# Altium schematic sheet BLOCK DIAGRAM.SchDoc
size A3; Date: 10/11/2025; Author: Hung Le; Revision: v1; SheetNumber: 2; SheetTotal: 3; Size: A3
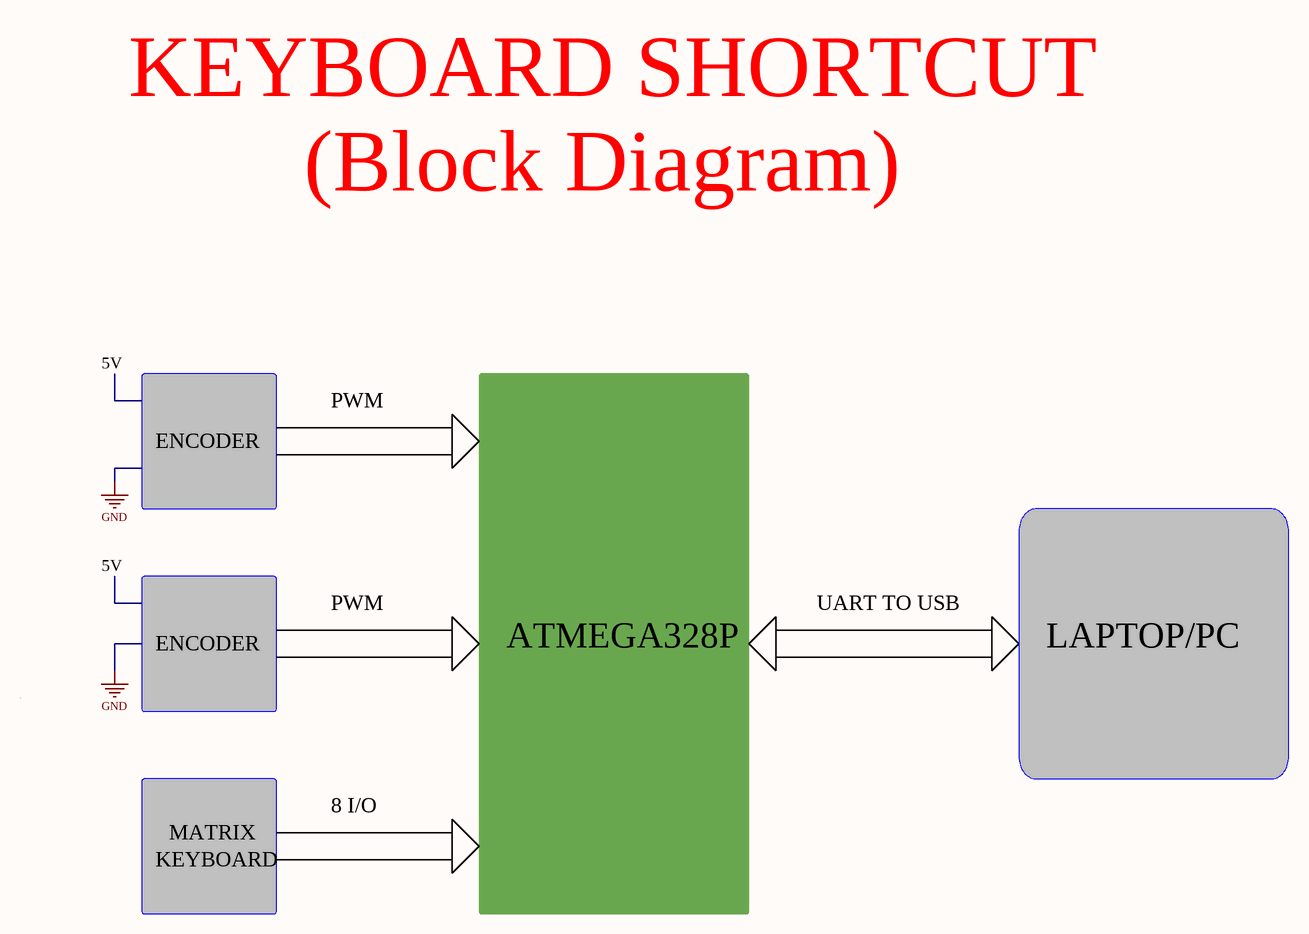
[diagram p0: BLOCK DIAGRAM.SchDoc]

## Notes on the sheet
- KEYBOARD SHORTCUT
- (Block Diagram)
- 5V
- ENCODER
- PWM
- ATMEGA328P
- UART TO USB
- LAPTOP/PC
- KEYBOARD
- MATRIX
- 8 I/O
- Project:
- Page Content:
- Revision:
- Size:
- Design by:
- Document number:
- Date:
- Sheet       of